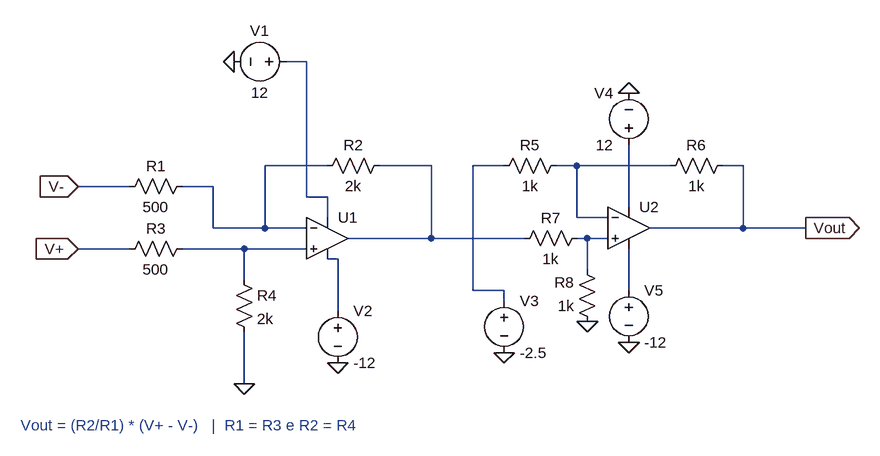
[diagram p0: schematic subtractor.asc]
subtractor.asc, the LTspice schematic file:
Version 4
SHEET 1 1344 680
WIRE 144 -128 112 -128
WIRE 176 32 80 32
WIRE 336 32 256 32
WIRE 448 32 400 32
WIRE 560 32 528 32
WIRE 704 32 560 32
WIRE 816 32 784 32
WIRE -128 64 -208 64
WIRE 0 64 -48 64
WIRE 144 80 144 -128
WIRE 176 80 144 80
WIRE 640 96 640 0
WIRE 176 112 176 80
WIRE 560 112 560 32
WIRE 608 112 560 112
WIRE 0 128 0 64
WIRE 80 128 80 32
WIRE 80 128 0 128
WIRE 144 128 80 128
WIRE 816 128 816 32
WIRE 816 128 672 128
WIRE 912 128 816 128
WIRE 336 144 336 32
WIRE 336 144 208 144
WIRE 480 144 336 144
WIRE 576 144 560 144
WIRE 608 144 576 144
WIRE -128 160 -208 160
WIRE 48 160 -48 160
WIRE 144 160 48 160
WIRE 192 176 176 176
WIRE 576 192 576 144
WIRE 48 208 48 160
WIRE 400 224 400 32
WIRE 448 224 400 224
WIRE 640 224 640 160
WIRE 448 240 448 224
WIRE 192 256 192 176
WIRE 48 368 48 288
FLAG 912 128 Vout
IOPIN 912 128 Out
FLAG -208 64 V-
IOPIN -208 64 In
FLAG -208 160 V+
IOPIN -208 160 In
FLAG 48 368 0
FLAG 32 -128 0
FLAG 192 336 0
FLAG 640 304 0
FLAG 640 -80 0
FLAG 448 320 0
FLAG 576 272 0
SYMBOL res 32 192 R0
SYMATTR InstName R4
SYMATTR Value 2k
SYMBOL res -32 144 R90
WINDOW 0 0 56 VBottom 2
WINDOW 3 32 56 VTop 2
SYMATTR InstName R3
SYMATTR Value 500
SYMBOL res -32 48 R90
WINDOW 0 0 56 VBottom 2
WINDOW 3 32 56 VTop 2
SYMATTR InstName R1
SYMATTR Value 500
SYMBOL res 272 16 R90
WINDOW 0 0 56 VBottom 2
WINDOW 3 32 56 VTop 2
SYMATTR InstName R2
SYMATTR Value 2k
SYMBOL voltage 128 -128 R90
WINDOW 0 -32 56 VBottom 2
WINDOW 3 32 56 VTop 2
WINDOW 123 0 0 Left 0
WINDOW 39 0 0 Left 0
SYMATTR InstName V1
SYMATTR Value 12
SYMBOL Opamps\\UniversalOpamp2 176 144 R0
SYMATTR InstName U1
SYMBOL voltage 192 240 R0
WINDOW 123 0 0 Left 0
WINDOW 39 0 0 Left 0
SYMATTR InstName V2
SYMATTR Value -12
SYMBOL Opamps\\UniversalOpamp2 640 128 R0
SYMATTR InstName U2
SYMBOL res 544 16 R90
WINDOW 0 0 56 VBottom 2
WINDOW 3 32 56 VTop 2
SYMATTR InstName R5
SYMATTR Value 1k
SYMBOL voltage 640 16 R180
WINDOW 0 24 96 Left 2
WINDOW 3 24 16 Left 2
WINDOW 123 0 0 Left 0
WINDOW 39 0 0 Left 0
SYMATTR InstName V4
SYMATTR Value 12
SYMBOL voltage 640 208 R0
WINDOW 123 0 0 Left 0
WINDOW 39 0 0 Left 0
SYMATTR InstName V5
SYMATTR Value -12
SYMBOL res 800 16 R90
WINDOW 0 0 56 VBottom 2
WINDOW 3 32 56 VTop 2
SYMATTR InstName R6
SYMATTR Value 1k
SYMBOL res 576 128 R90
WINDOW 0 0 56 VBottom 2
WINDOW 3 32 56 VTop 2
SYMATTR InstName R7
SYMATTR Value 1k
SYMBOL voltage 448 224 R0
WINDOW 123 0 0 Left 0
WINDOW 39 0 0 Left 0
SYMATTR InstName V3
SYMATTR Value -2.5
SYMBOL res 592 288 R180
WINDOW 0 36 76 Left 2
WINDOW 3 36 40 Left 2
SYMATTR InstName R8
SYMATTR Value 1k
TEXT -296 432 Left 2 ;Vout = (R2/R1) * (V+ - V-)   |  R1 = R3 e R2 = R4

The netlist it stands for:
* subtractor.asc
R4 N008 0 2k
R3 N008 V+ 500
R1 N002 V- 500
R2 N003 N002 2k
V1 N001 0 12
XU1 N008 N002 N001 N009 N003 level.2 Avol=1Meg GBW=10Meg Slew=10Meg ilimit=25m rail=0 Vos=0 phimargin=45 en=0 enk=0 in=0 ink=0 Rin=500Meg  ; pins IN+ IN- V+ V- OUT
V2 N009 0 -12
XU2 N007 N005 N006 N010 Vout level.2 Avol=1Meg GBW=10Meg Slew=10Meg ilimit=25m rail=0 Vos=0 phimargin=45 en=0 enk=0 in=0 ink=0 Rin=500Meg  ; pins IN+ IN- V+ V- OUT
R5 N005 N004 1k
V4 N006 0 12
V5 N010 0 -12
R6 Vout N005 1k
R7 N007 N003 1k
V3 N004 0 -2.5
R8 0 N007 1k
* Vout = (R2/R1) * (V+ - V-)   |  R1 = R3 e R2 = R4
.lib UniversalOpamps2.sub
.backanno
.end